# Altium schematic sheet Sheet_Connection.SchDoc
size A4
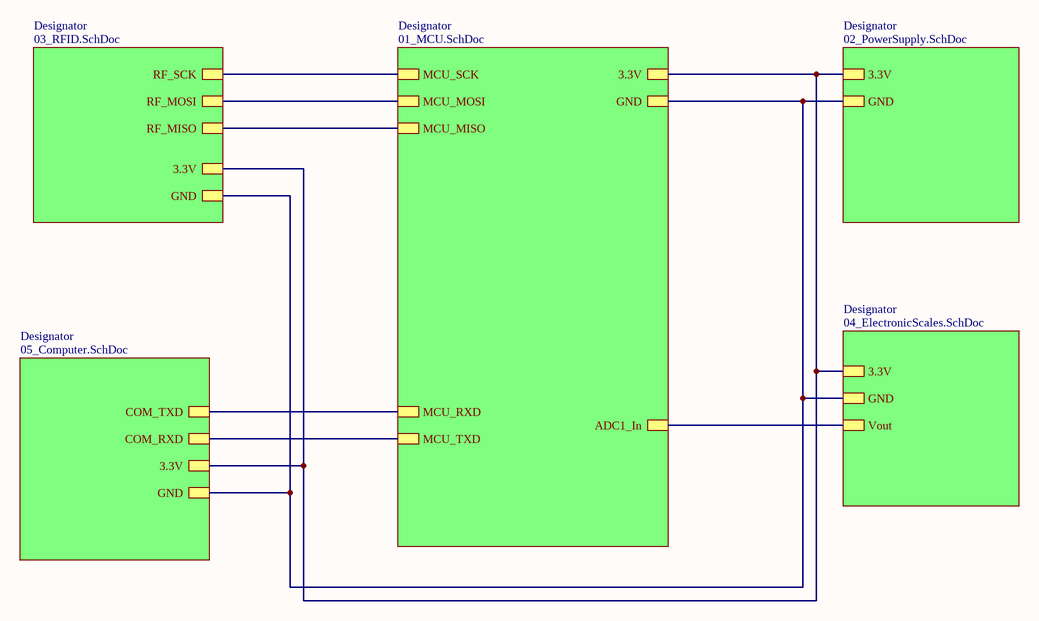
[diagram p0: Sheet_Connection.SchDoc]

## Sub-sheets
Designator = 01_MCU.SchDoc: 3.3V, GND, ADC1_In, MCU_SCK, MCU_MOSI, MCU_MISO, MCU_TXD, MCU_RXD
Designator = 02_PowerSupply.SchDoc: 3.3V, GND
Designator = 04_ElectronicScales.SchDoc: Vout, GND, 3.3V
Designator = 03_RFID.SchDoc: RF_SCK, RF_MOSI, RF_MISO, 3.3V, GND
Designator = 05_Computer.SchDoc: COM_TXD, COM_RXD, 3.3V, GND

## Nets
(unnamed): sheet Designator/3.3V, sheet Designator/3.3V, sheet Designator/3.3V, sheet Designator/3.3V, sheet Designator/3.3V
(unnamed): sheet Designator/GND, sheet Designator/GND, sheet Designator/GND, sheet Designator/GND, sheet Designator/GND
(unnamed): sheet Designator/ADC1_In, sheet Designator/Vout
(unnamed): sheet Designator/MCU_SCK, sheet Designator/RF_SCK
(unnamed): sheet Designator/MCU_MOSI, sheet Designator/RF_MOSI
(unnamed): sheet Designator/MCU_MISO, sheet Designator/RF_MISO
(unnamed): sheet Designator/MCU_TXD, sheet Designator/COM_RXD
(unnamed): sheet Designator/MCU_RXD, sheet Designator/COM_TXD

## Notes on the sheet
- Project:
- MANDevices
- Page Contents:
- Size:
- Date:
- A4
- Checked by:
- Time:
- Revision:
- Sheet
- of
- HaNoi University of
- Science and Technology
- File: